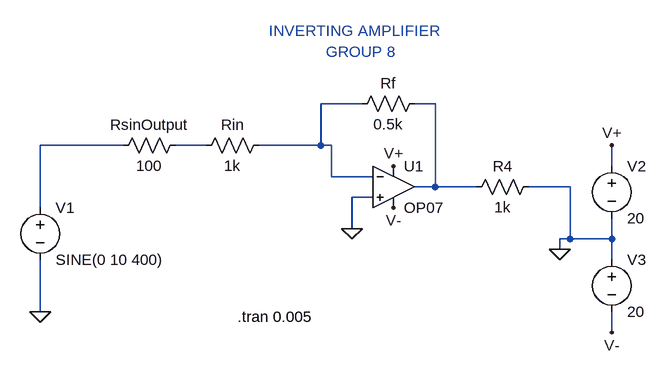
[diagram p0: schematic InvertingAmpC.asc]
InvertingAmpC.asc, the LTspice schematic file:
Version 4
SHEET 1 880 680
WIRE 352 32 288 32
WIRE 464 32 432 32
WIRE -16 96 -144 96
WIRE 112 96 64 96
WIRE 288 96 288 32
WIRE 288 96 192 96
WIRE 304 96 288 96
WIRE 736 128 736 96
WIRE 304 144 304 96
WIRE 368 144 304 144
WIRE 464 160 464 32
WIRE 464 160 432 160
WIRE 528 160 464 160
WIRE 672 160 608 160
WIRE 368 176 336 176
WIRE -144 192 -144 96
WIRE 336 224 336 176
WIRE 672 240 672 160
WIRE 672 240 656 240
WIRE 736 240 736 208
WIRE 736 240 672 240
WIRE 656 256 656 240
WIRE 736 272 736 240
WIRE -144 352 -144 272
WIRE 736 384 736 352
FLAG -144 352 0
FLAG 336 224 0
FLAG 656 256 0
FLAG 736 384 V-
FLAG 400 192 V-
FLAG 400 128 V+
FLAG 736 96 V+
SYMBOL voltage -144 176 R0
WINDOW 123 0 0 Left 2
WINDOW 39 0 0 Left 2
SYMATTR InstName V1
SYMATTR Value SINE(0 10 400)
SYMBOL voltage 736 112 R0
SYMATTR InstName V2
SYMATTR Value 20
SYMBOL voltage 736 256 R0
WINDOW 123 0 0 Left 2
WINDOW 39 0 0 Left 2
SYMATTR InstName V3
SYMATTR Value 20
SYMBOL res 80 80 R90
WINDOW 0 0 56 VBottom 2
WINDOW 3 32 56 VTop 2
SYMATTR InstName RsinOutput
SYMATTR Value 100
SYMBOL res 208 80 R90
WINDOW 0 0 56 VBottom 2
WINDOW 3 32 56 VTop 2
SYMATTR InstName Rin
SYMATTR Value 1k
SYMBOL res 448 16 R90
WINDOW 0 0 56 VBottom 2
WINDOW 3 32 56 VTop 2
SYMATTR InstName Rf
SYMATTR Value 0.5k
SYMBOL res 624 144 R90
WINDOW 0 0 56 VBottom 2
WINDOW 3 32 56 VTop 2
SYMATTR InstName R4
SYMATTR Value 1k
SYMBOL OpAmps\\OP07 400 96 R0
SYMATTR InstName U1
TEXT 208 -80 Left 2 ;INVERTING AMPLIFIER
TEXT 296 -48 Left 2 ;GROUP 8
TEXT 160 360 Left 2 !.tran 0.005

The netlist it stands for:
* InvertingAmpC.asc
V1 N003 0 SINE(0 10 400)
V2 V+ 0 20
V3 0 V- 20
RsinOutput N004 N003 100
Rin N001 N004 1k
Rf N002 N001 0.5k
R4 0 N002 1k
XU1 0 N001 V+ V- N002 LT1001  ; OP07, pins In+ In- V+ V- OUT
* INVERTING AMPLIFIER
* GROUP 8
.tran 0.005
.lib LTC.lib
.backanno
.end